# Altium schematic sheet Votage Reguator.SchDoc
size A4
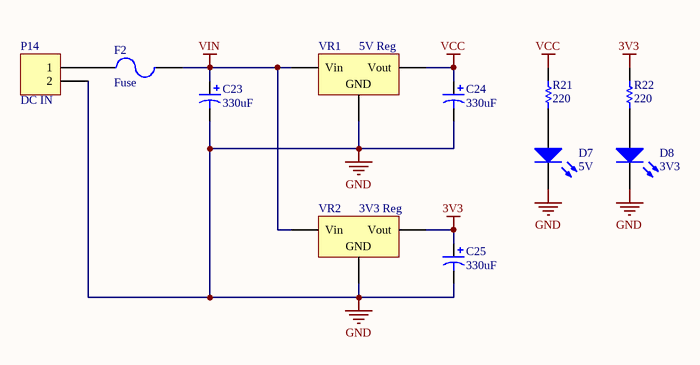
[diagram p0: Votage Reguator.SchDoc]

## Parts
C23  330uF  [SV-C]
C24  330uF  [SV-C]
C25  330uF  [SV-C]
D7  5V  [CHIPLED_0603]
D8  3V3  [CHIPLED_0603]
F2  Fuse  [FUSE-HOLDER-SMD]
P14  DC IN  [DEANS]
R21  220  [0603-RES]
R22  220  [0603-RES]
VR1  5V Reg  [OKI-78SRH]
VR2  3V3 Reg  [OKI-78SRH]

## Nets
3V3: C25.1 R22.2 VR2.3(Vout)
GND: C23.2 C24.2 C25.2 D7.2(K) D8.2(K) P14.2 VR1.2(GND) VR2.2(GND)
VCC: C24.1 R21.2 VR1.3(Vout)
VIN: C23.1 F2.2 VR1.1(Vin) VR2.1(Vin)
NetD7_1: D7.1(A) R21.1
NetD8_1: D8.1(A) R22.1
NetF2_1: F2.1 P14.1

## Library data of the parts
C23-C25 = Cap Pol: Polarized Capacitor (Axial); Published: 8-Jun-2000; LatestRevisionDate: 17-Jul-2002; LatestRevisionNote: Re-released for DXP Platform.; PackageReference: POLAR0.8; Publisher: Altium Limited; PackageDescription: Polarized Capacitor; 2 Leads; Value: 330uF
D7 D8 = LED: Typical INFRARED GaAs LED; Published: 8-Jun-2000; LatestRevisionDate: 08-Jul-2005; LatestRevisionNote: Mech Layer 1 removed.; PackageReference: LED-0; Publisher: Altium Limited; PackageDescription: LED; 2 Leads
P14 = Header 2: Header, 2-Pin; LatestRevisionDate: 17-Jul-2002; LatestRevisionNote: Re-released for DXP Platform.; Publisher: Altium Limited
R21 R22 = Res: Resistor; Published: 8-Jun-2000; LatestRevisionDate: 17-Jul-2002; LatestRevisionNote: Re-released for DXP Platform.; PackageReference: AXIAL-0.3; Publisher: Altium Limited; PackageDescription: Axial Device, Thru-Hole; 2 Leads; 0.3 in Pin Spacing; Value: 220
VR1 VR2 = Volt Reg: Voltage Regulator; Published: 24-Mar-1999; LatestRevisionDate: 29-May-2009; LatestRevisionNote: IPC-7351 Footprint Added.; PackageReference: D2PAK; Publisher: Altium Limited; PackageDescription: 3-Pin Transistor Outline Package 2.54 mm Pitch, 15.1 mm Lead Span
F2 = Fuse: Published: 8-Jun-2000; LatestRevisionDate: 17-Jul-2002; LatestRevisionNote: Re-released for DXP Platform.; PackageReference: PIN-W2/E2.8; Publisher: Altium Limited; PackageDescription: Thru-Hole; 2 Leads